# EAGLE design hall_mitsuba (EAGLE 9.1.1)
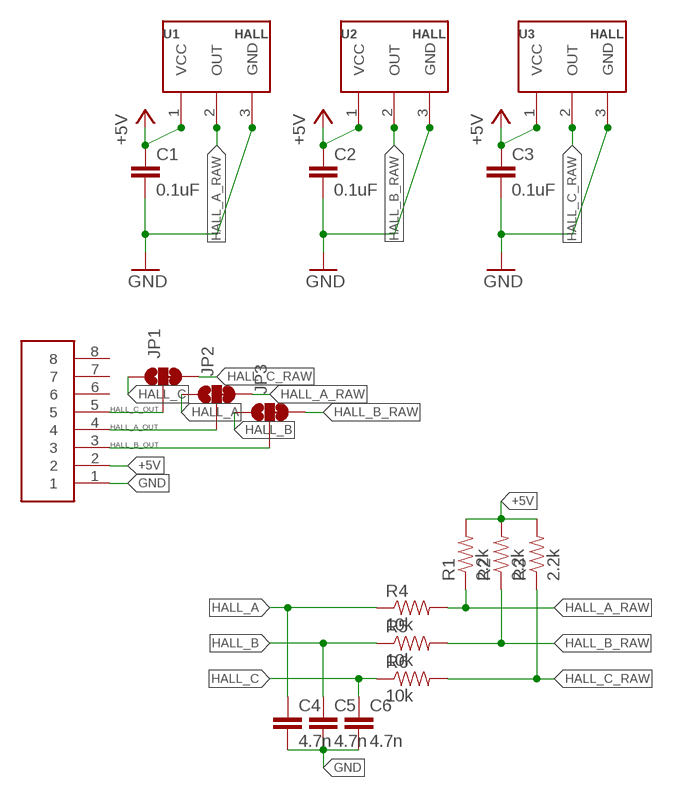
[diagram p0: schematic, sheet 1]

## Parts
C1  0.1uF  CAP0603-CAP  [0603-CAP]
C2  0.1uF  CAP0603-CAP  [0603-CAP]
C3  0.1uF  CAP0603-CAP  [0603-CAP]
C4  4.7n  CAP0603-CAP  [0603-CAP]
C5  4.7n  CAP0603-CAP  [0603-CAP]
C6  4.7n  CAP0603-CAP  [0603-CAP]
JP1  JUMPER-SMT_3_1-NC_TRACE_SILK  [SMT-JUMPER_3_1-NC_TRACE_SILK]
JP2  JUMPER-SMT_3_1-NC_TRACE_SILK  [SMT-JUMPER_3_1-NC_TRACE_SILK]
JP3  JUMPER-SMT_3_1-NC_TRACE_SILK  [SMT-JUMPER_3_1-NC_TRACE_SILK]
R1  2.2k  RESISTOR0603-RES  [0603-RES]
R2  2.2k  RESISTOR0603-RES  [0603-RES]
R3  2.2k  RESISTOR0603-RES  [0603-RES]
R4  10k  RESISTOR0603-RES  [0603-RES]
R5  10k  RESISTOR0603-RES  [0603-RES]
R6  10k  RESISTOR0603-RES  [0603-RES]
U1  HALL_SOT23W  [SOT23W]
U2  HALL_SOT23W  [SOT23W]
U3  HALL_SOT23W  [SOT23W]
U$1  HEADER8DEFAULT  [8PINVALULOK]

## Nets
+5V: C1.1 C2.1 C3.1 R1.2 R2.2 R3.2 U1.1(VCC) U2.1(VCC) U3.1(VCC) U$1.2
GND: C1.2 C2.2 C3.2 C4.2 C5.2 C6.2 U1.3(GND) U2.3(GND) U3.3(GND) U$1.1
HALL_A: C4.1 JP2.1 R4.1
HALL_A_OUT: JP2.2 U$1.4
HALL_A_RAW: JP2.3 R1.1 R4.2 U1.2(OUT)
HALL_B: C5.1 JP3.1 R5.1
HALL_B_OUT: JP3.2 U$1.3
HALL_B_RAW: JP3.3 R2.1 R5.2 U2.2(OUT)
HALL_C: C6.1 JP1.1 R6.1
HALL_C_OUT: JP1.2 U$1.5
HALL_C_RAW: JP1.3 R3.1 R6.2 U3.2(OUT)
Unconnected: U$1.6 U$1.7 U$1.8

## Library data of the parts
C1-C6 = SparkFun-Passives:CAP: Capacitor Standard 0603 ceramic capacitor, and 0.1" leaded capacitor.
JP1-JP3 = SparkFun-Jumpers:JUMPER-SMT_3_1-NC_TRACE: Normally closed trace jumper (1 of 2 connections) This jumper has a trace between two pads so it's normally closed (NC). The other connection is normally open (NO). Use a razor knife to open the connection. For best results follow the IPC guidelines for cutting traces: Cutout at least 0.063 mm (0.005 in). Remove all loose material to clean up the cut area. Seal the cut with an approved epoxy. Reapply solder to reclose the connection, or to close the NO connection.
R1-R6 = SparkFun-Passives:RESISTOR: Resistor Basic schematic elements and footprints for 0603, 1206, and PTH resistors.
U1-U3 = Custom_new:HALL
U$1 = Custom_new:HEADER8

## Board
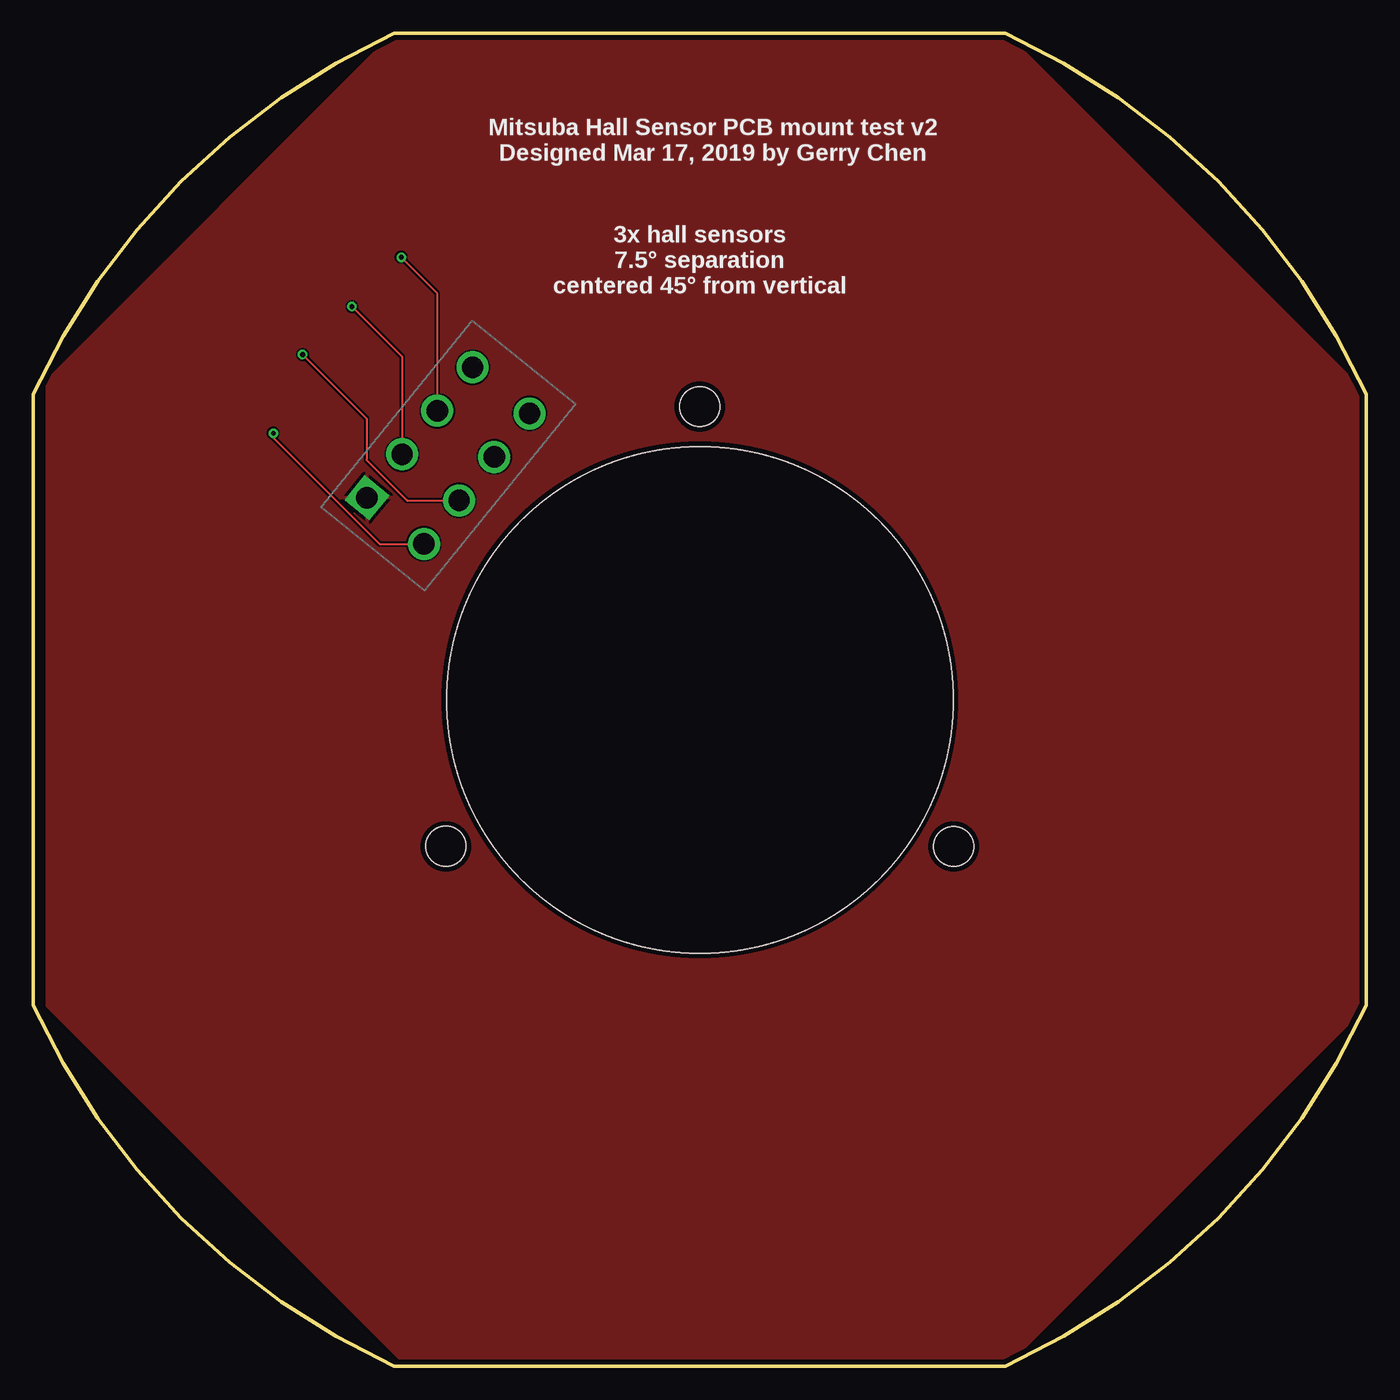
[diagram p1: board, top side]
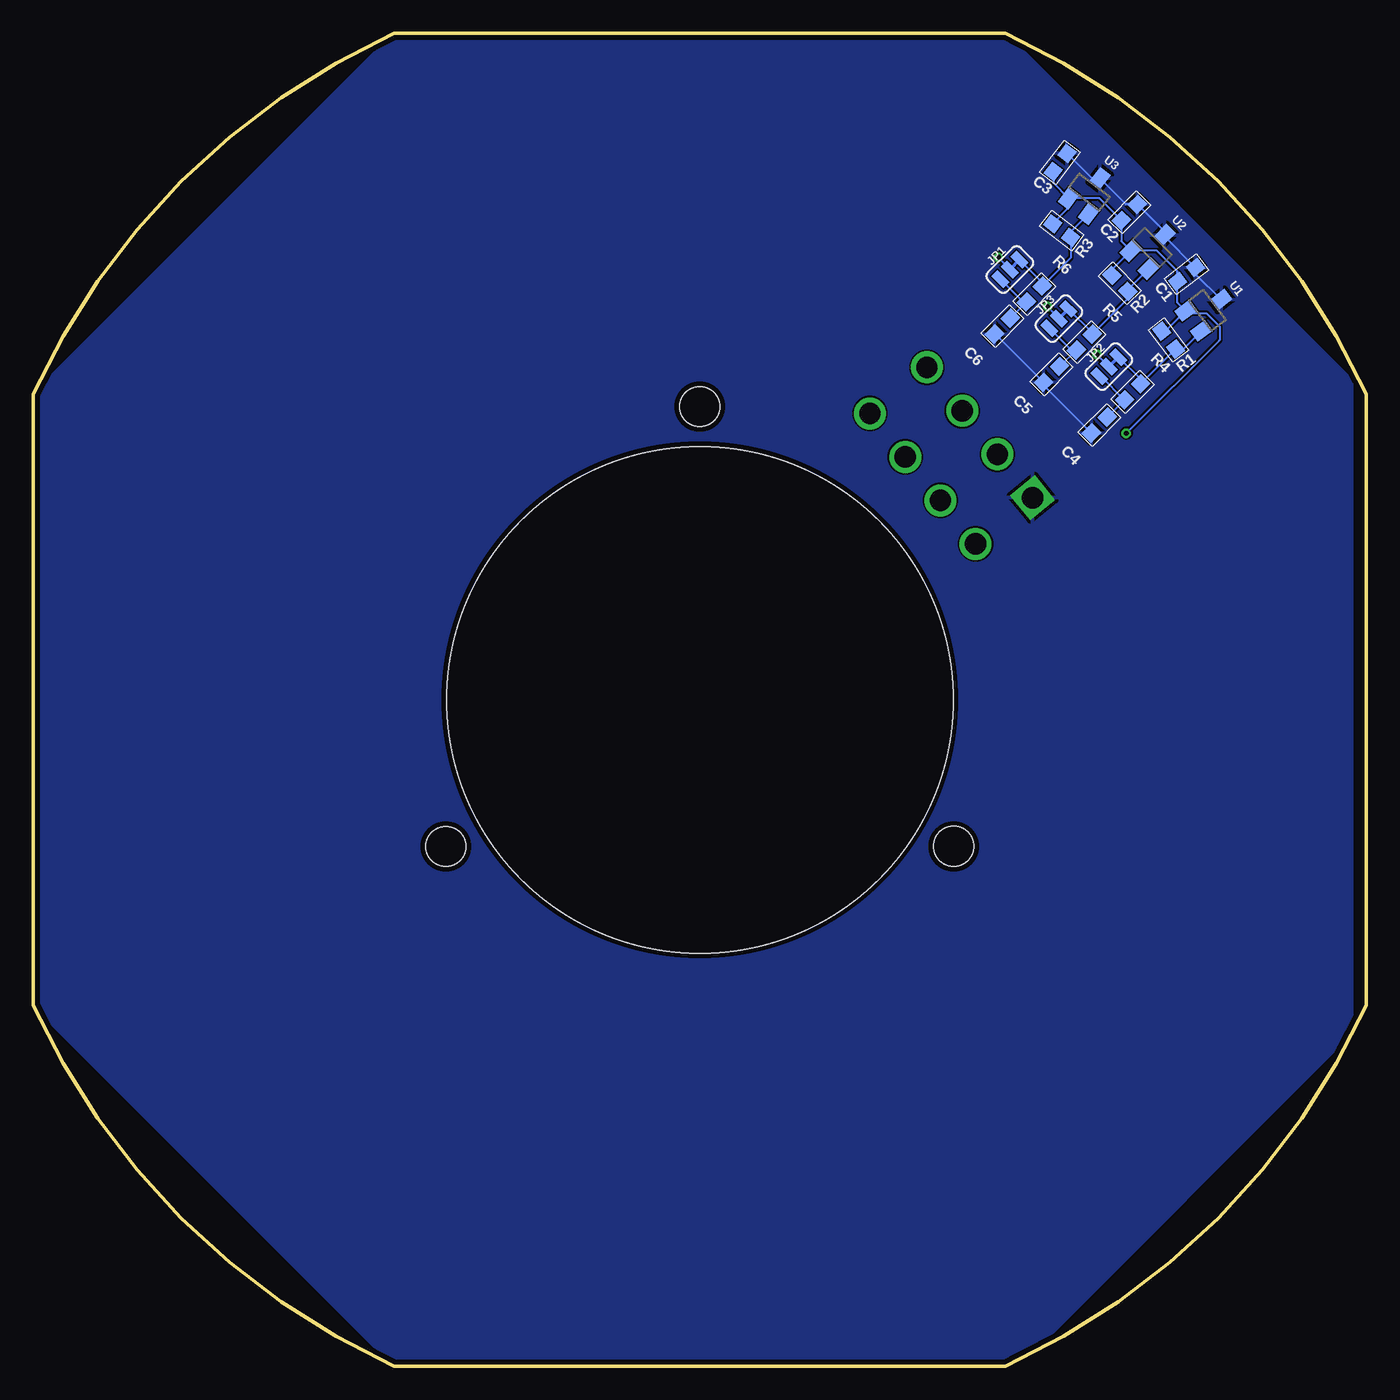
[diagram p2: board, bottom side, seen from below]

Size 100 x 100 mm. Coordinates in mm from the lower left corner, seen from the top.
Outline: 27.09,100 arc41 0,72.91 0,27.09 arc41 27.09,0 72.91,0 arc41 100,27.09 100,72.91 arc41 72.91,100 27.09,100
Copper layers (1*16): Top 0.0356mm / dielectric 1.5011mm / Bottom 0.0356mm
Design rules "jlcpcb_tented": minimum track width 5mil, minimum drill 13mil, track to track 5mil, track to pad 5mil, pad to pad 5mil, via to via 5mil, smd to smd 5mil, copper to edge 15mil, drill to drill 6mil, minimum pad ring 7mil, minimum via ring 7mil, stop-mask expansion 2.5mil, vias tented up to drill 0.35mm, thermal gap 10mil
Holes 3 mm at 69.05,39 30.95,39 50,72
Holes 38 mm at 50,50

### Footprints (pad centres in the part's own frame; a part is rotated, then mirrored left to right if it is on the bottom)
0603-CAP = smd 1.1 x 1: 1 -0.85,0; 2 0.85,0
SMT-JUMPER_3_1-NC_TRACE_SILK = smd 0.635 x 1.27: 1 -1.016,0; 2 0,0; 3 1.016,0
0603-RES = smd 1.1 x 1: 1 -0.85,0; 2 0.85,0
SOT23W = smd 1 x 1.4: 1 -0.95,-1.303; 2 0.95,-1.303; 3 0,1.303
8PINVALULOK = drill 1.6 square: 1 0,5.5 | drill 1.6: 2 0,0; 3 4.2,5.5; 4 4.2,0; 5 8.4,5.5; 6 8.4,0; 7 12.6,5.5; 8 12.6,0

### Placement (x,y rotation side)
C1  13.48,81.92 37.5 bottom
C2  17.77,86.57 45 bottom
C3  22.97,90.32 52.5 bottom
C4  20.01,70.62 225 bottom
C5  23.61,74.41 225 bottom
C6  27.29,78.04 225 bottom
JP1  26.73,82.28 45 bottom
JP2  19.3,75 45 bottom
JP3  23.05,78.61 45 bottom
R1  14.83,76.99 127.5 bottom
R2  18.49,81.24 135 bottom
R3  22.84,85.2 142.5 bottom
R4  17.53,73.1 45 bottom
R5  21.14,76.84 45 bottom
R6  24.89,80.44 45 bottom
U1  11.92,79.22 307.5 bottom
U2  16.06,83.94 315 bottom
U3  20.78,88.08 322.5 bottom
U$1  29.3,61.69 51 top
U$2  [DEV]  7,60 0 top
U$3  [DEV]  79,51 0 top

### Tracks (layer width: path | path; a pad name or v marks a point on that pad's centre or on a via)
+5V  (via drill 0.35)
  Top 0.152: U$1.2 25.99,61.69 18,69.68 v18,70
  Bottom 0.152: C3.1 23.49,88.79 U3.1 | U2.1 18.37,84.41 C2.1 20.03,87.63 U3.1 | U2.1 15.69,83.69 14.15,82.15 C1.1 14.15,79.8 U1.1 | U1.1 13.35,79 12,79 11,78 11,77 v18,70 | U2.1 19.09,82.26 R2.2 | U1.1 15.05,77.66 R1.2 | U3.1 22.33,86.91 R3.2
GND
  Bottom 0.152: U1.3 12.81,81.93 C1.2 15.14,84.77 U2.3 15.14,85.14 C2.2 18.04,87.17 U3.3 20.57,89.12 C3.2 | C4.2 24.21,73.61 C5.2 27.83,77.44 C6.2
  pour Top: 1,27 1,74 27,100 73,100 100,73 100,27 73,0 28,0
  pour Top: 1,27 1,74 27,100 73,100 100,73 100,27 73,0 28,0
  pour Bottom: 1,25 1,74 27,100 73,100 100,73 100,27 73,0 26,0
HALL_A
  Bottom 0.152: C4.1 R4.1 19.91,74.28 JP2.1 | C4.1
HALL_A_OUT  (via drill 0.35)
  Top 0.152: v20.2,75.9 25,71.1 25,68 28.05,64.95 U$1.4
  Bottom 0.152: JP2.2 v20.2,75.9
HALL_A_RAW
  Bottom 0.152: U1.2 13.74,76.31 R1.1 R4.2 16.92,74.06 JP2.3
HALL_B
  Bottom 0.152: C5.1 22.96,75.02 R5.1 22.12,76.24 JP3.1
HALL_B_OUT  (via drill 0.35)
  Top 0.152: v23.9,79.5 27.67,75.73 U$1.3
  Bottom 0.152: JP3.2 23.9,79.46 v23.9,79.5
HALL_B_RAW
  Bottom 0.152: U2.2 17.88,80.77 R2.1 17.88,80.09 R5.2 20.54,77.53 JP3.3
HALL_C
  Bottom 0.152: JP1.1 25.73,79.84 R6.1 C6.1
HALL_C_OUT  (via drill 0.35)
  Top 0.152: v27.6,83.2 30.31,80.49 U$1.5
  Bottom 0.152: JP1.2 27.6,83.16 v27.6,83.2
HALL_C_RAW
  Bottom 0.152: U3.2 22.17,85.12 R3.1 22.17,83.16 R6.2 24.29,81.28 JP1.3

### Text on the board
tPlace: Mitsuba Hall Sensor PCB mount test v2 / Designed Mar 17, 2019 by Gerry Chen | 3x hall sensors / 7.5° separation / centered 45° from vertical
Reference: 240° / (32 poles) = 7.5° separation